# Altium schematic sheet Mạch Thu.SchDoc
size A4; SheetNumber: 2; SheetTotal: 2
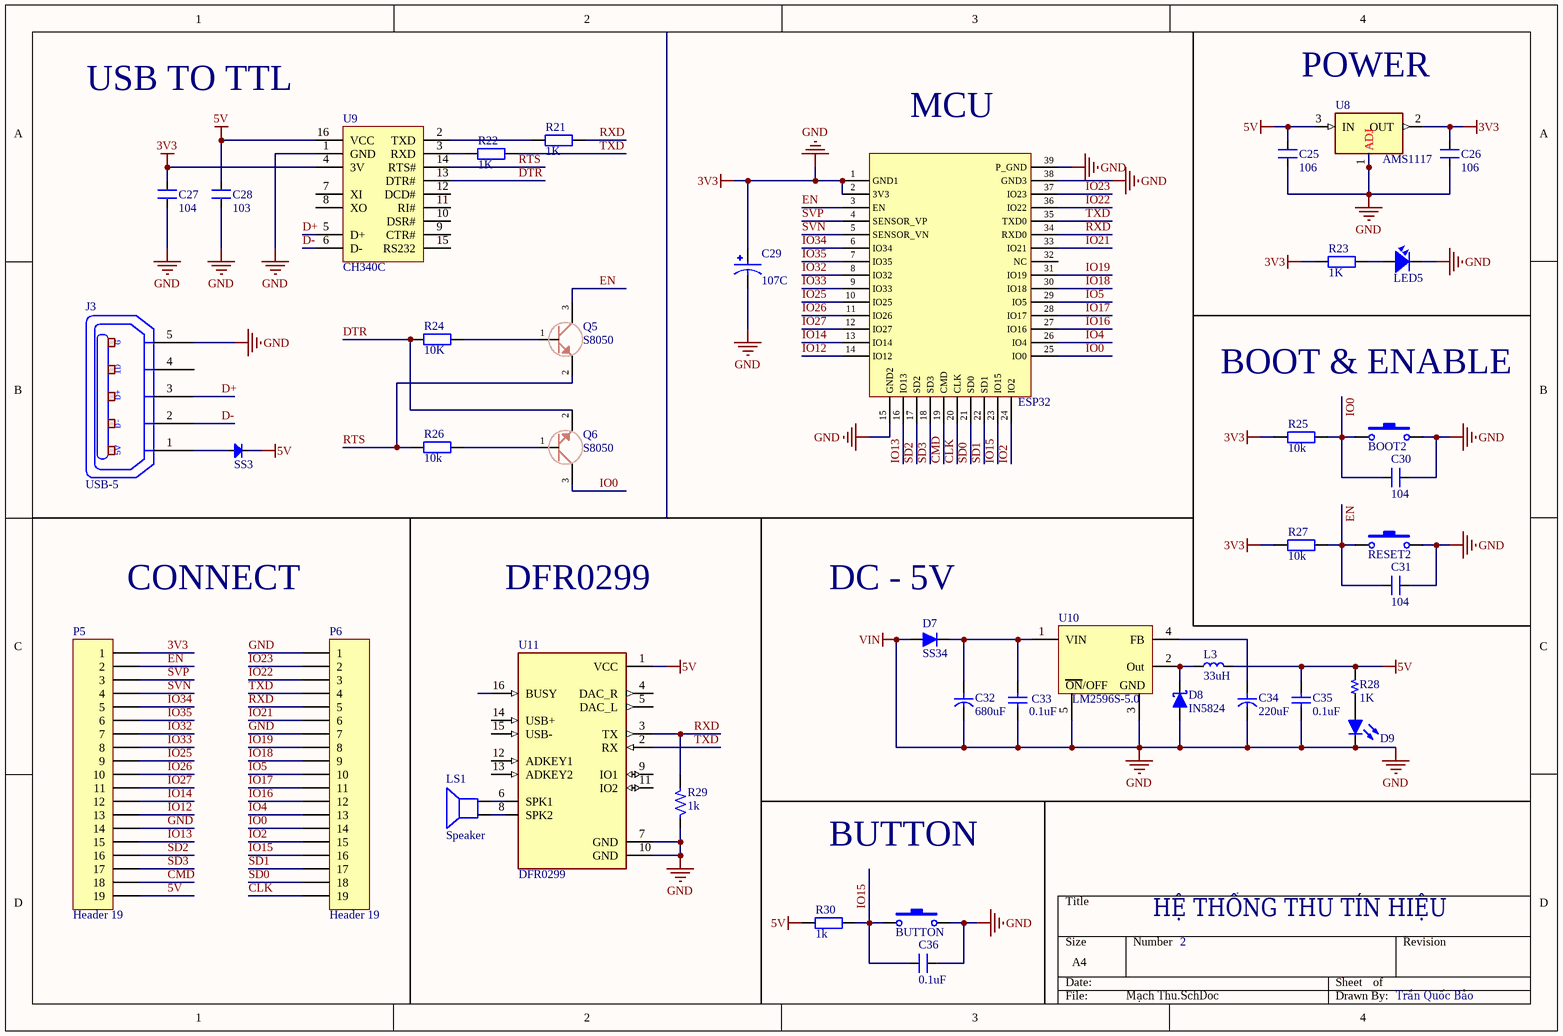
[diagram p0: Mạch Thu.SchDoc]

## Parts
BOOT2  SW-SMD  [SW-SMD]  (value not drawn)
BUTTON  SW-SMD  [SW-SMD]  (value not drawn)
C25  106  [SM-0805]
C26  106  [SM-0805]
C27  104  [SM-0805]
C28  103  [SM-0805]
C29  107C  [CAP_TANTALUM_3528]
C30  104  [SM-0805]
C31  104  [SM-0805]
C32  680uF  [C SMD TAN 1206 (A)]
C33  0.1uF  [C 0805]
C34  220uF  [C SMD TAN 1206 (A)]
C35  0.1uF  [C 0805]
C36  0.1uF  [SM-0805]
D7  SS34  [DO-35 (SOD27 )]
D8  IN5824  [DO-41]
D9  Led  [Led 0805 RED]  (value not drawn)
ESP32  ESP32  [ESP_WROOM_32]  (value not drawn)
J3  USB-5  [USB-M1]
L3  33uH  [Inductor SMD 12x12x8]
LED5  LED  [LED 3512]  (value not drawn)
LS1  Speaker  [SPEAKER]
P5  Header 19  [HDR1X19]
P6  Header 19  [HDR1X19]
Q5  S8050  [SOT23]
Q6  S8050  [SOT23]
R21  value 1K  [DIEN TRO 0805]  (hidden comment: R0805)
R22  value 1K  [DIEN TRO 0805]  (hidden comment: R0805)
R23  value 1K  [DIEN TRO 0805]  (hidden comment: R0805)
R24  value 10K  [DIEN TRO 0805]  (hidden comment: R0805)
R25  value 10k  [DIEN TRO 0805]  (hidden comment: R0805)
R26  value 10k  [DIEN TRO 0805]  (hidden comment: R0805)
R27  value 10k  [DIEN TRO 0805]  (hidden comment: R0805)
R28  1K  [R 0805]
R29  1k  [R1/8W]
R30  value 1k  [DIEN TRO 0805]  (hidden comment: R0805)
RESET2  SW-SMD  [SW-SMD]  (value not drawn)
SS3  Diode SMD  [DIO-SMD-106]  (value not drawn)
U8  AMS1117  [SOT223-4N]
U9  CH340C  [SO16]
U10  LM2596S-5.0  [TO-263-5]
U11  DFR0299  [MODULE_DFR0299]

## Nets
3V3: BOOT2.2 BUTTON.2 C25.1 C26.1 C26.2 C27.1 C27.2 C28.1 C29.1 C29.2 C30.1 C31.1 C32.2 C33.2 C34.2 C35.2 C36.1 D7.1(A) D8.1(A) D9.2(K) ESP32.1(GND1) ESP32.2(3V3) ESP32.15(GND2) ESP32.38(GND3) ESP32.39(P_GND) J3.5(P5) LED5.2 P5.1 P5.14 P6.1 P6.7 R23.1 R25.1 R27.1 R29.1 RESET2.2 U8.1(ADJ) U8.2(OUT) U9.1(GND) U9.4(3V) U10.3(GND) U10.5(~{ON}/OFF) U11.7(GND) U11.10(GND)  [also labelled GND, VIN]
5V: C25.2 C28.2 C35.1 L3.2 P5.19 R28.2 R30.1 SS3.2(K) U8.3(IN) U9.16(VCC) U11.1(VCC)
CLK: ESP32.20(CLK) P6.19
CMD: ESP32.19(CMD) P5.18
D+: J3.3(P3) U9.5(D+)
D-: J3.2(P2) U9.6(D-)
DTR: Q6.2(E) R24.1 U9.13(DTR#)
EN: C31.2 ESP32.3(EN) P5.2 Q5.3(C) R27.2 RESET2.1
IO0: BOOT2.1 C30.2 ESP32.25(IO0) P6.14 Q6.3(C) R25.2
IO2: ESP32.24(IO2) P6.15
IO4: ESP32.26(IO4) P6.13
IO5: ESP32.29(IO5) P6.10
IO12: ESP32.14(IO12) P5.13
IO13: ESP32.16(IO13) P5.15
IO14: ESP32.13(IO14) P5.12
IO15: BUTTON.1 C36.2 ESP32.23(IO15) P6.16 R30.2
IO16: ESP32.27(IO16) P6.12
IO17: ESP32.28(IO17) P6.11
IO18: ESP32.30(IO18) P6.9
IO19: ESP32.31(IO19) P6.8
IO21: ESP32.33(IO21) P6.6
IO22: ESP32.36(IO22) P6.3
IO23: ESP32.37(IO23) P6.2
IO25: ESP32.10(IO25) P5.9
IO26: ESP32.11(IO26) P5.10
IO27: ESP32.12(IO27) P5.11
IO32: ESP32.8(IO32) P5.7
IO33: ESP32.9(IO33) P5.8
IO34: ESP32.6(IO34) P5.5
IO35: ESP32.7(IO35) P5.6
RTS: Q5.2(E) R26.1 U9.14(RTS#)
RXD: ESP32.34(RXD0) P6.5 R21.2 R29.2 U11.3(TX)
SD0: ESP32.21(SD0) P6.18
SD1: ESP32.22(SD1) P6.17
SD2: ESP32.17(SD2) P5.16
SD3: ESP32.18(SD3) P5.17
SVN: ESP32.5(SENSOR_VN) P5.4
SVP: ESP32.4(SENSOR_VP) P5.3
TXD: ESP32.35(TXD0) P6.4 R22.2 U11.2(RX)
NetC32_1: C32.1 C33.1 D7.2(K) U10.1(VIN)
NetC34_1: C34.1 U10.4(FB)
NetD8_2: D8.2(K) L3.1 U10.2(Out)
NetD9_1: D9.1(A) R28.1
NetJ3_1: J3.1(P1) SS3.1(A)
NetLED5_1: LED5.1 R23.2
NetLS1_1: LS1.1 U11.8(SPK2)
NetLS1_2: LS1.2 U11.6(SPK1)
NetQ5_1: Q5.1(B) R24.2
NetQ6_1: Q6.1(B) R26.2
NetR21_1: R21.1 U9.2(TXD)
NetR22_1: R22.1 U9.3(RXD)

Not connected (* = marked no-connect by the designer): ESP32 32(NC); J3 4(P4); U9 7(XI) 8(XO) 9(CTR#) 10(DSR#) 11(RI#) 12(DCD#) 15(RS232); U10 6(PAD); U11 4(DAC_R) 5(DAC_L) 9(IO1) 11(IO2) 12(ADKEY1) 13(ADKEY2) 14(USB+) 15(USB-) 16(BUSY)

## Notes on the sheet
- USB TO TTL
- (near U8) POWER
- (near ESP32) MCU
- BOOT & ENABLE
- CONNECT
- DFR0299
- (near D7) DC - 5V
- BUTTON
- HỆ THỐNG THU TÍN HIỆU
- 2
- Trần Quốc Bảo
- (in symbol LM2596S-5.0) ON/OFF
- (in symbol USB-5) G; ID; D+; D-; 5V

## Library data of the parts
BOOT2 BUTTON RESET2 = SW-SMD: Switch; Published: 24-Mar-1999; LatestRevisionDate: 17-Jul-2002; LatestRevisionNote: Re-released for DXP Platform.; PackageReference: SPST-2; Publisher: Altium Limited
C25-C27 C30 C31 C36 = CM: Cap SMD; Value: 103
C28 = CM: Cap SMD; Value: 103
C29 = CAP_TANTALUM_SMD: Capacitor, Tantalum; MF: AVX; MP: TAJB475K025RNJ; SnapEDA_Link: https://www.snapeda.com/parts/TAJB475K025RNJ/AVX/view-part/?ref=snap; Package: 1411 AVX Corporation; Value: *; Check_prices: https://www.snapeda.com/parts/TAJB475K025RNJ/AVX/view-part/?ref=eda
C32 C34 = Capacitor: Capacitor pol
C33 C35 = Capacitor NP: Capacitor non-pol
D7 = Diode: Default Diode
D8 = Diode Schottky: Schottky Diode
D9 = Led: Typical LED
ESP32 = ESP-WROOM-32
J3 = USB-5: Manufacturer: FCI; Manufacturer Part Number: 10118193-0001LF; Connector Type: USB - micro B; Number of Contacts: 5; Gender: Receptacle; Specifications: USB 2.0; .Creator: MM; .Checked PCB: RF; Supplier 1: Digi-Key; RoHS: RoHS Compliant; Category: Connectors, Interconnects; Stock 1: 28642; Pricing 1: 1=0.46, 10=0.433, 25=0.3712, 50=0.3156, 100=0.3032, 250=0.27224, 500=0.25988 (USD); Packaging: Cut Tape (CT); Mounting Type: Surface Mount, Right Angle, Horizontal; Features: Shielded, Solder Retention; Ingress Protection: -; ComponentLink1URL: http://portal.fciconnect.com/Comergent//fci/drawing/10118193.pdf; ComponentLink1Description: http://portal.fciconnect.com/Comergent//fci/drawing/10118193.pdf; Supplier Part Number 1: 609-4616-1-ND; .Checked SCH: MM
L3 = Inductor
LED5 = LED SMD: Value: LED 3 - 5 ly 2 Colour
LS1 = Speaker: Loudspeaker; Published: 24-Mar-1999; LatestRevisionDate: 17-Jul-2002; LatestRevisionNote: Re-released for DXP Platform.; PackageReference: PIN2; Publisher: Altium Limited
P5 P6 = Header 19: Header, 19-Pin; LatestRevisionDate: 17-Jul-2002; LatestRevisionNote: Re-released for DXP Platform.; Publisher: Altium Limited
Q5 Q6 = Transitor SMD
R21-R27 R30 = R0805: Resistor SMD 0805; Published: 8-Jun-2000; LatestRevisionDate: 17-Jul-2002; LatestRevisionNote: Re-released for DXP Platform.; PackageReference: AXIAL-0.4; Publisher: Altium Limited
R28 = Resistor
R29 = R: Resistor 1/4W; Value: R1/4W - 1K
SS3 = Diode SMD: Default Diode; Code - JEDEC: DO-214-AB; Value: 1N5007; Published: 8-Jun-2000; Revision: July-2002: Re-released for DXP Platform.; Publisher: Altium Limited
U8 = AMS1117: IC
U9 = CH340G: High and Low Side Driver; Note: Pins 4, 8 and 14 are not connected; Published: 8-Jun-2000; LatestRevisionDate: 04-Mar-2005; LatestRevisionNote: Stylized 3D Model Added.; DatasheetVersion: PD60147J; PackageReference: PDIP14; Publisher: Altium Limited; PackageDescription: DIP; 14 Leads; Row Spacing 7.62 mm; Pitch 2.54 mm; ComponentLink1Description: Manufacturer Link; ComponentLink1URL: http://www.irf.com/; ComponentLink2Description: Datasheet; ComponentLink2URL: http://www.irf.com/product-info/datasheets/data/ir2110.pdf
U10 = LM2596S-5.0: Simple Switcher 3A Step-Down Voltage Regulator
U11 = DFR0299: Dfplayer - a Mini Mp3 Player; Package: None; Price: None; Value: *; MP: DFR0299; Availability: Unavailable